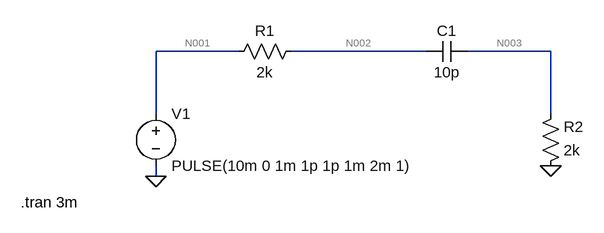
[diagram p0: schematic ed1.asc]
ed1.asc, the LTspice schematic file:
Version 4
SHEET 1 880 680
WIRE 32 224 -96 224
WIRE 320 224 112 224
WIRE 512 224 384 224
WIRE -96 320 -96 224
WIRE 512 320 512 224
WIRE -96 416 -96 400
FLAG -96 416 0
FLAG 512 400 0
SYMBOL voltage -96 304 R0
WINDOW 123 0 0 Left 0
WINDOW 39 0 0 Left 0
SYMATTR InstName V1
SYMATTR Value PULSE(10m 0 1m 1p 1p 1m 2m 1)
SYMBOL res 128 208 R90
WINDOW 0 0 56 VBottom 2
WINDOW 3 32 56 VTop 2
SYMATTR InstName R1
SYMATTR Value 2k
SYMBOL res 496 416 M180
WINDOW 0 36 76 Left 2
WINDOW 3 36 40 Left 2
SYMATTR InstName R2
SYMATTR Value 2k
SYMBOL cap 384 208 R90
WINDOW 0 0 32 VBottom 2
WINDOW 3 32 32 VTop 2
SYMATTR InstName C1
SYMATTR Value 10p
TEXT -304 456 Left 2 !.tran 3m

The netlist it stands for:
* ed1.asc
V1 N001 0 PULSE(10m 0 1m 1p 1p 1m 2m 1)
R1 N002 N001 2k
R2 0 N003 2k
C1 N003 N002 10p
.tran 3m
.backanno
.end

* Results of the author's LTspice run, read from the files saved beside the schematic
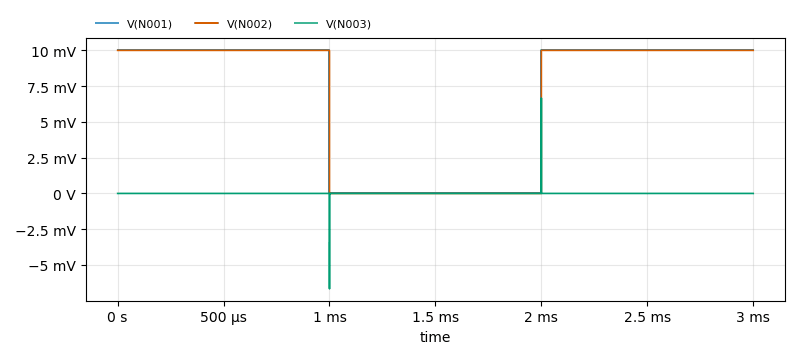
[diagram p1: Transient Analysis of ed1.asc, plotted from the saved traces]
* Transient Analysis, 1 run:
*   V(N001): min 0 V, max 10 mV, average 6.667 mV, rms 8.165 mV, last 10 mV
*   V(N002): min 0 V, max 10 mV, average 6.667 mV, rms 8.165 mV, last 10 mV
*   V(N003): min -6.667 mV, max 6.667 mV, average -13.17 nV, rms 21.72 µV, last 0 V